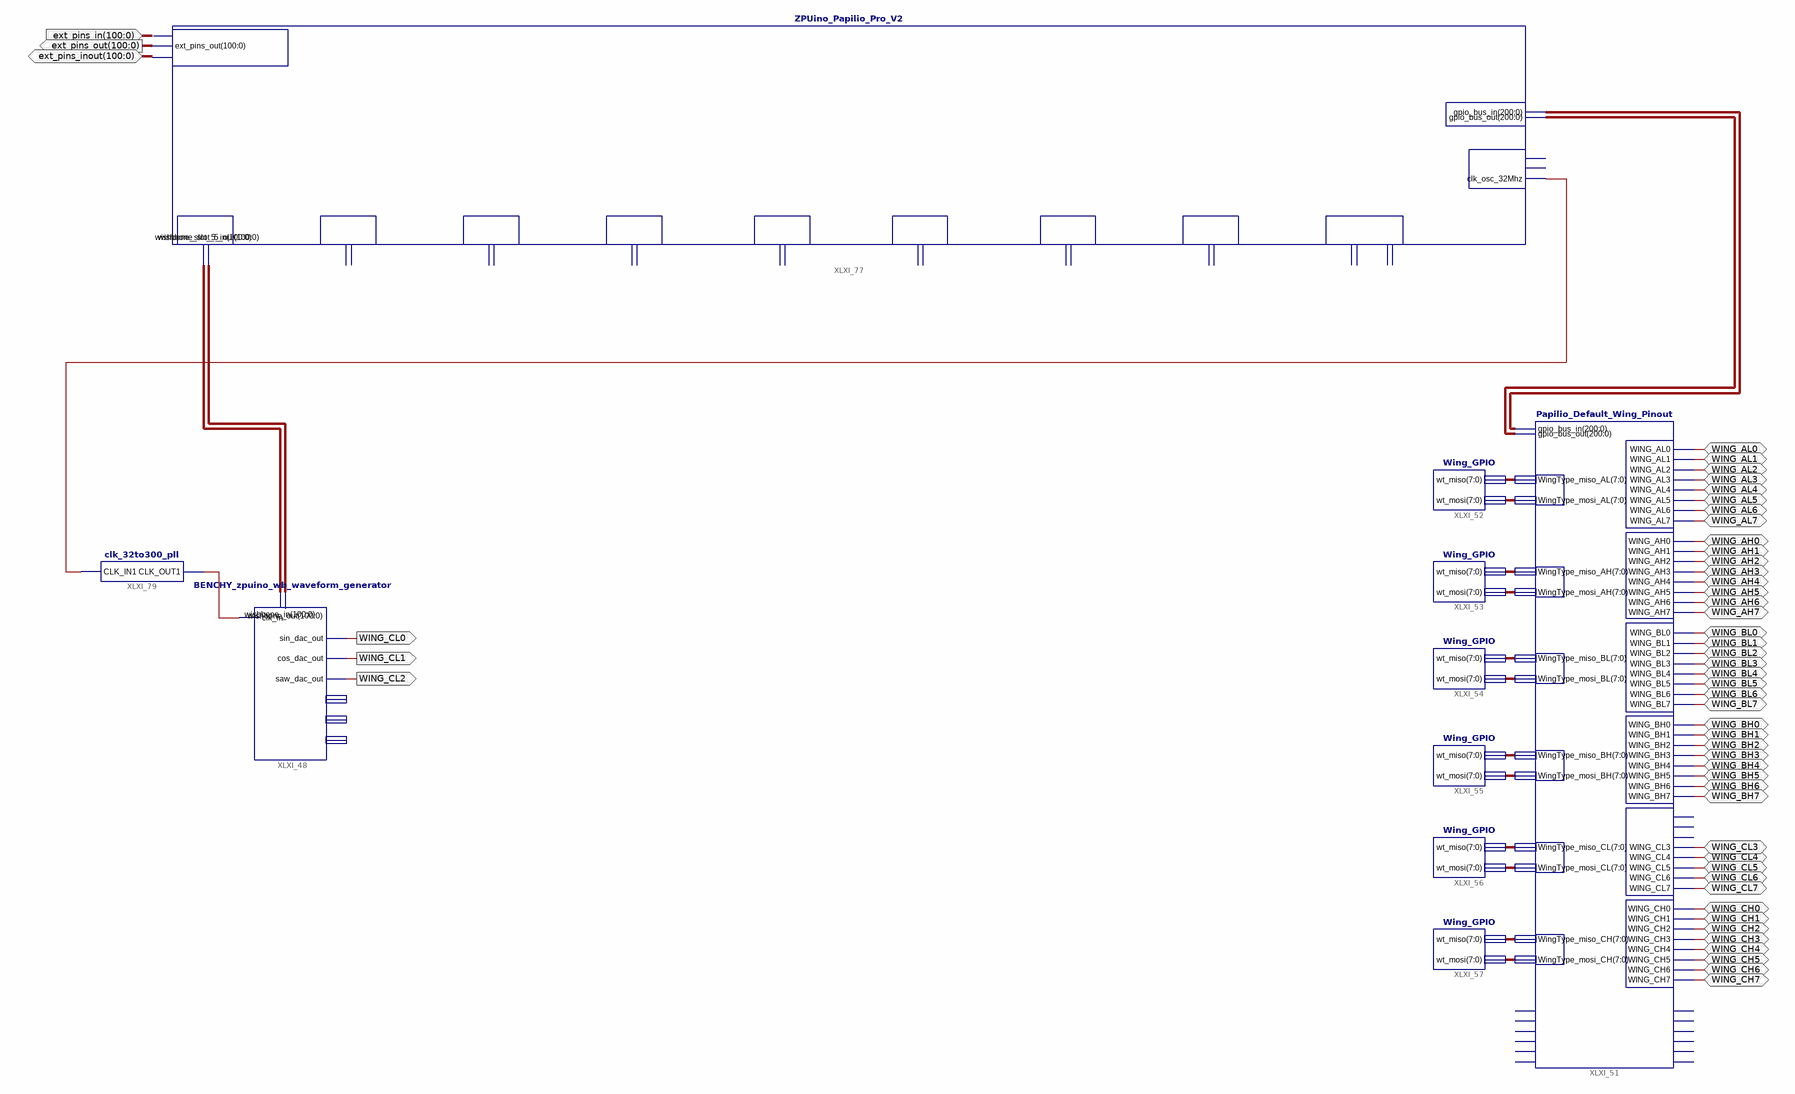
[diagram p0: schematic sheet 1]
// Xilinx ISE schematic Papilio_Pro.sch (spartan6) as structural Verilog: 10 symbols, 51 ports
module Papilio_Pro (
  input  [100:0] ext_pins_in,
  inout  WING_AL0,
  inout  WING_AL1,
  inout  WING_AL2,
  inout  WING_AL3,
  inout  WING_AL4,
  inout  WING_AL5,
  inout  WING_AL6,
  inout  WING_AL7,
  inout  WING_AH0,
  inout  WING_AH1,
  inout  WING_AH2,
  inout  WING_AH3,
  inout  WING_AH4,
  inout  WING_AH5,
  inout  WING_AH6,
  inout  WING_AH7,
  inout  WING_BL0,
  inout  WING_BL1,
  inout  WING_BL2,
  inout  WING_BL3,
  inout  WING_BL4,
  inout  WING_BL5,
  inout  WING_BL6,
  inout  WING_BL7,
  inout  WING_BH0,
  inout  WING_BH1,
  inout  WING_BH2,
  inout  WING_BH3,
  inout  WING_BH4,
  inout  WING_BH5,
  inout  WING_BH6,
  inout  WING_BH7,
  inout  WING_CH0,
  inout  WING_CH1,
  inout  WING_CH2,
  inout  WING_CH3,
  inout  WING_CH4,
  inout  WING_CH5,
  inout  WING_CH6,
  inout  WING_CH7,
  inout  WING_CL4,
  inout  WING_CL5,
  inout  WING_CL6,
  inout  WING_CL7,
  inout  WING_CL3,
  inout  [100:0] ext_pins_inout,
  output WING_CL0,
  output WING_CL1,
  output WING_CL2,
  output [100:0] ext_pins_out
);

  wire XLXN_466, XLXN_475;
  wire [7:0] XLXN_480, XLXN_481, XLXN_482, XLXN_483, XLXN_484, XLXN_485, XLXN_486, XLXN_487, XLXN_488,
       XLXN_489, XLXN_490, XLXN_491;
  wire [100:0] XLXN_521, XLXN_522;
  wire [200:0] XLXN_408, XLXN_409;

  BENCHY_zpuino_wb_waveform_generator XLXI_48 (
    .saw_dac_out(WING_CL2), .sin_dac_out(WING_CL0), .cos_dac_out(WING_CL1), .clk_in(XLXN_475),
    .wishbone_in(XLXN_521), .wishbone_out(XLXN_522));  // open: saw_out, sin_out, cos_out
  Papilio_Default_Wing_Pinout XLXI_51 (
    .WING_AH0(WING_AH0), .WING_AH1(WING_AH1), .WING_AH2(WING_AH2), .WING_AH3(WING_AH3), .WING_AH4(WING_AH4),
    .WING_AH5(WING_AH5), .WING_AH6(WING_AH6), .WING_AH7(WING_AH7), .WING_AL0(WING_AL0), .WING_AL1(WING_AL1),
    .WING_AL2(WING_AL2), .WING_AL3(WING_AL3), .WING_AL4(WING_AL4), .WING_AL5(WING_AL5), .WING_AL6(WING_AL6),
    .WING_AL7(WING_AL7), .WING_BH0(WING_BH0), .WING_BH1(WING_BH1), .WING_BH2(WING_BH2), .WING_BH3(WING_BH3),
    .WING_BH4(WING_BH4), .WING_BH5(WING_BH5), .WING_BH6(WING_BH6), .WING_BH7(WING_BH7), .WING_BL0(WING_BL0),
    .WING_BL1(WING_BL1), .WING_BL2(WING_BL2), .WING_BL3(WING_BL3), .WING_BL4(WING_BL4), .WING_BL5(WING_BL5),
    .WING_BL6(WING_BL6), .WING_BL7(WING_BL7), .WING_CL3(WING_CL3), .WING_CL4(WING_CL4), .WING_CL5(WING_CL5),
    .WING_CL6(WING_CL6), .WING_CL7(WING_CL7), .WING_CH0(WING_CH0), .WING_CH1(WING_CH1), .WING_CH2(WING_CH2),
    .WING_CH3(WING_CH3), .WING_CH4(WING_CH4), .WING_CH5(WING_CH5), .WING_CH6(WING_CH6), .WING_CH7(WING_CH7),
    .gpio_bus_out(XLXN_408), .gpio_bus_in(XLXN_409), .WingType_miso_BH(XLXN_486),
    .WingType_miso_BL(XLXN_484), .WingType_miso_AH(XLXN_482), .WingType_mosi_BL(XLXN_485),
    .WingType_mosi_BH(XLXN_487), .WingType_mosi_CL(XLXN_489), .WingType_mosi_AH(XLXN_483),
    .WingType_miso_CL(XLXN_488), .WingType_miso_CH(XLXN_490), .WingType_mosi_CH(XLXN_491),
    .WingType_mosi_AL(XLXN_481), .WingType_miso_AL(XLXN_480));  // open: WING_CL0, WING_CL1, WING_CL2, Flex_Pin_out_0, Flex_Pin_out_1, Flex_Pin_out_2, Flex_Pin_out_3, Flex_Pin_out_4, Flex_Pin_out_5, Flex_Pin_in_0, Flex_Pin_in_1, Flex_Pin_in_2, Flex_Pin_in_3, Flex_Pin_in_4, Flex_Pin_in_5
  Wing_GPIO XLXI_52 (.wt_miso(XLXN_480), .wt_mosi(XLXN_481));
  Wing_GPIO XLXI_53 (.wt_miso(XLXN_482), .wt_mosi(XLXN_483));
  Wing_GPIO XLXI_54 (.wt_miso(XLXN_484), .wt_mosi(XLXN_485));
  Wing_GPIO XLXI_55 (.wt_miso(XLXN_486), .wt_mosi(XLXN_487));
  Wing_GPIO XLXI_56 (.wt_miso(XLXN_488), .wt_mosi(XLXN_489));
  Wing_GPIO XLXI_57 (.wt_miso(XLXN_490), .wt_mosi(XLXN_491));
  ZPUino_Papilio_Pro_V2 XLXI_77 (
    .gpio_bus_out(XLXN_408), .gpio_bus_in(XLXN_409), .clk_osc_32Mhz(XLXN_466), .ext_pins_in(ext_pins_in),
    .ext_pins_out(ext_pins_out), .ext_pins_inout(ext_pins_inout), .wishbone_slot_5_out(XLXN_522),
    .wishbone_slot_5_in(XLXN_521));  // open: clk_96Mhz, clk_1Mhz, wishbone_slot_6_in, wishbone_slot_6_out, wishbone_slot_8_in, wishbone_slot_8_out, wishbone_slot_9_in, wishbone_slot_9_out, wishbone_slot_10_in, wishbone_slot_10_out, wishbone_slot_11_in, wishbone_slot_11_out, wishbone_slot_12_in, wishbone_slot_12_out, wishbone_slot_13_in, wishbone_slot_13_out, wishbone_slot_14_in, wishbone_slot_14_out, wishbone_slot_video_in, wishbone_slot_video_out
  clk_32to300_pll XLXI_79 (.CLK_IN1(XLXN_466), .CLK_OUT1(XLXN_475));
endmodule
